# Altium schematic sheet Driver Board Port.SchDoc
size A4; SheetNumber: 3; SheetTotal: 5
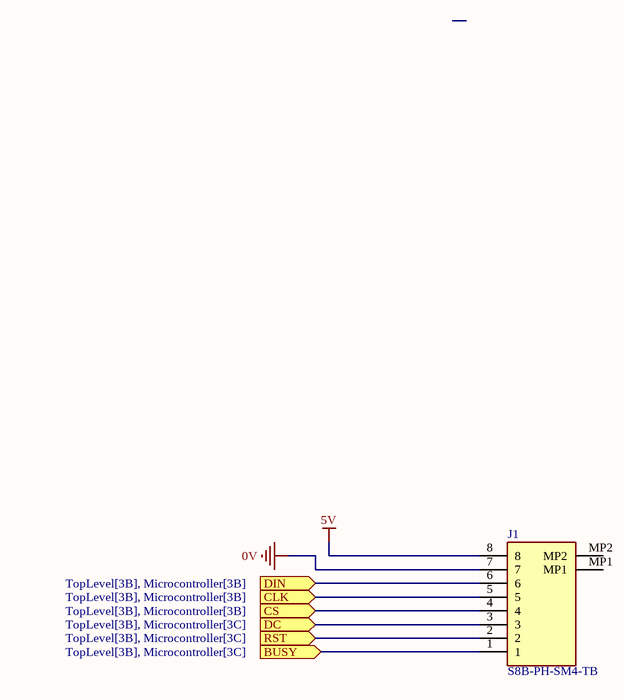
[diagram p0: Driver Board Port.SchDoc]

## Parts
J1  S8B-PH-SM4-TB  [S8BPHSM4TB]

## Ports
BUSY (in, see TopLevel[3B], Microcontroller[3C]), CLK (in, see TopLevel[3B], Microcontroller[3B]), CS (in, see TopLevel[3B], Microcontroller[3B]), DC (in, see TopLevel[3B], Microcontroller[3C]), DIN (in, see TopLevel[3B], Microcontroller[3B]), RST (in, see TopLevel[3B], Microcontroller[3C])

## Nets
0V: J1.7
5V: J1.8
BUSY: J1.1 ; port BUSY
CLK: J1.5 ; port CLK
CS: J1.4 ; port CS
DC: J1.3 ; port DC
DIN: J1.6 ; port DIN
RST: J1.2 ; port RST

Not connected (* = marked no-connect by the designer): J1 MP1 MP2

## Library data of the parts
J1 = S8B-PH-SM4-TB: Connector; Manufacturer_Name: JST (JAPAN SOLDERLESS TERMINALS); Height: 5.5mm; Manufacturer_Part_Number: S8B-PH-SM4-TB